# EAGLE design final_project3 (EAGLE 9.6.2)
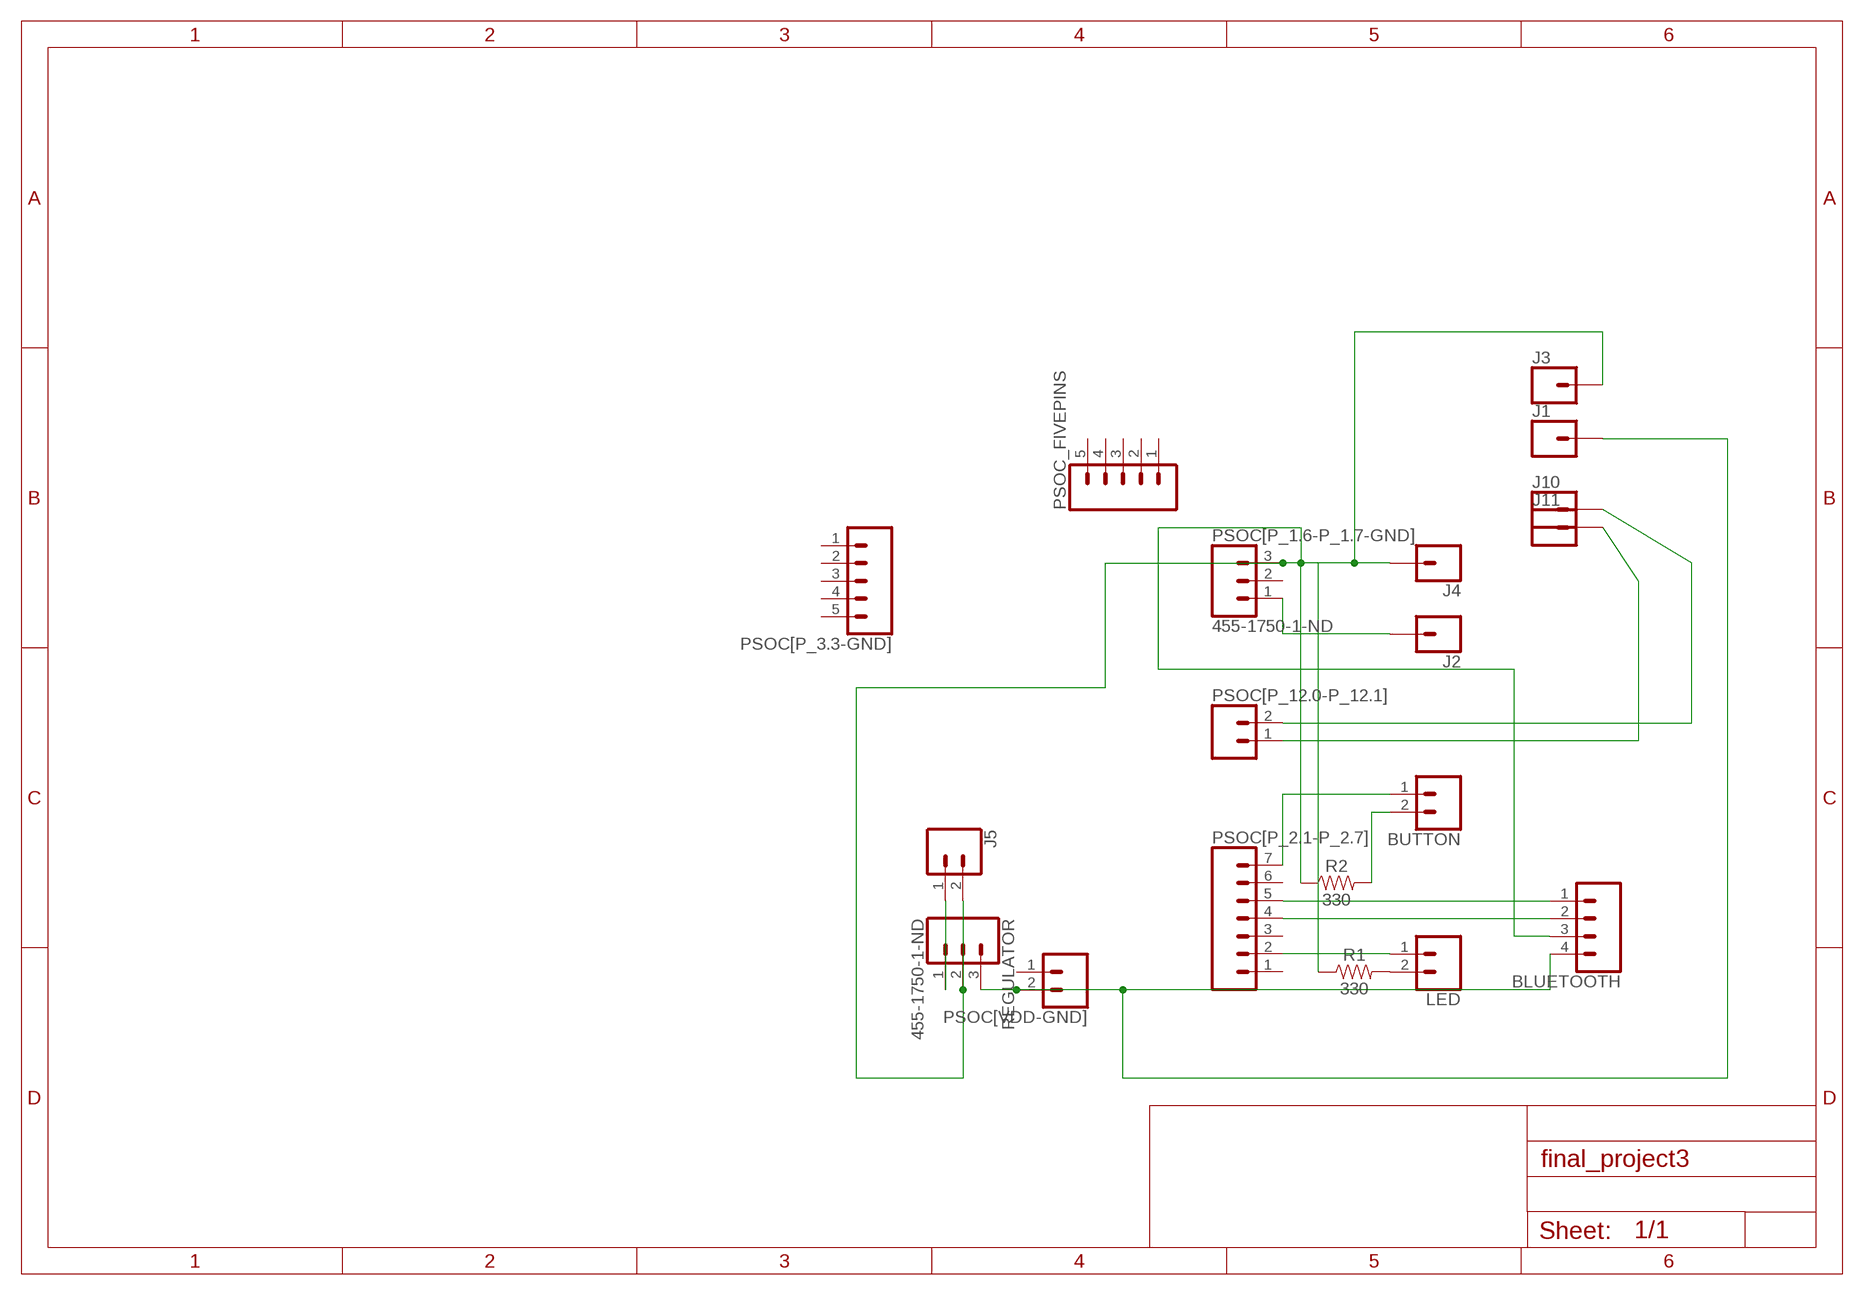
[diagram p0: schematic, sheet 1]

## Parts
BLUETOOTH  CONN_04  [1X04]
BUTTON  CONN_02  [1X02]
J1  CONN_01  [1X01]
J2  CONN_01  [1X01]
J3  CONN_01  [1X01]
J4  CONN_01  [1X01]
J5  CONN_02  [1X02]
J10  CONN_01  [1X01]
J11  CONN_01  [1X01]
LED  CONN_02  [1X02]
PSOC[P_1.6-P_1.7-GND]  455-1750-1-ND  CONN_03  [1X03]
PSOC[P_2.1-P_2.7]  CONN_07  [1X07]
PSOC[P_3.3-GND]  CONN_05  [1X05]
PSOC[P_12.0-P_12.1]  CONN_02  [1X02]
PSOC[VDD-GND]  CONN_02  [1X02]
PSOC_FIVEPINS  CONN_05  [1X05]
R1  330  330OHM-HORIZ-1/10W-5%  [AXIAL-0.3]
R2  330  330OHM-HORIZ-1/10W-5%  [AXIAL-0.3]
REGULATOR  455-1750-1-ND  CONN_03  [1X03]

## Nets
BUTTON: BUTTON.1 PSOC[P_2.1-P_2.7].7
GND3: BLUETOOTH.3 J3.1 J4.1 J5.2 PSOC[P_1.6-P_1.7-GND].3 R1.P$1 R2.P$1 REGULATOR.2
LED: LED.1 PSOC[P_2.1-P_2.7].2
N$1: J5.1 REGULATOR.1
N$2: J2.1 PSOC[P_1.6-P_1.7-GND].1
N$3: J11.1 PSOC[P_12.0-P_12.1].1
N$4: J10.1 PSOC[P_12.0-P_12.1].2
R_BUTTON: BUTTON.2 R2.P$2
R_LED: LED.2 R1.P$2
RX_BT-TX_PSOC: BLUETOOTH.1 PSOC[P_2.1-P_2.7].5
TX_BT-RX_PSOC: BLUETOOTH.2 PSOC[P_2.1-P_2.7].4
VDD: BLUETOOTH.4 J1.1 PSOC[VDD-GND].2 REGULATOR.3
Unconnected: PSOC[P_1.6-P_1.7-GND].2 PSOC[P_2.1-P_2.7].1 PSOC[P_2.1-P_2.7].3 PSOC[P_2.1-P_2.7].6 PSOC[P_3.3-GND].1 PSOC[P_3.3-GND].2 PSOC[P_3.3-GND].3 PSOC[P_3.3-GND].4 PSOC[P_3.3-GND].5 PSOC[VDD-GND].1 PSOC_FIVEPINS.1 PSOC_FIVEPINS.2 PSOC_FIVEPINS.3 PSOC_FIVEPINS.4 PSOC_FIVEPINS.5

## Library data of the parts
BLUETOOTH = SparkFun-Connectors:CONN_04: Multi connection point. Often used as Generic Header-pin footprint for 0.1 inch spaced/style header connections On any of the 0.1 inch spaced packages, you can populate with these: Break Away Headers - Straight <https://www.sparkfun.com/products/116> (PRT-00116) Break Away Male Headers - Right Angle <https://www.sparkfun.com/products/553> (PRT-00553) Female Headers <https://www.sparkfun.com/products/115> (PRT-00115) Break Away Headers - Machine Pin <https://www.sparkfun.com/products/117> (PRT-00117) Break Away Female Headers - Swiss Machine Pin <https://www.sparkfun.com/products/743> (PRT-00743) For SCREWTERMINALS and SPRING TERMINALS visit here: Screw Terimnals on SparkFun.com <https://www.sparkfun.com/search/results?term=Screw+Terminals> (5mm/3.5mm/2.54mm spacing) This device is also useful as a general connection point to wire up your design to another part of your project. Our various solder wires solder well into these plated through hole pads. Hook-Up Wire - Assortment (Stranded, 22 AWG) <https://www.sparkfun.com/products/11375> (PRT-11375) Hook-Up Wire - Assortment (Solid Core, 22 AWG) <https://www.sparkfun.com/products/11367> (PRT-11367) View the entire wire category on our website here <https://www.sparkfun.com/categories/141> Special notes: Molex polarized connector foot print use with SKU : PRT-08231 with associated crimp pins and housings. 1MM SMD Version SKU: PRT-10208; PROD_ID: CONN-09696
BUTTON J5 LED PSOC[P_12.0-P_12.1] PSOC[VDD-GND] = SparkFun-Connectors:CONN_02: Multi connection point. Often used as Generic Header-pin footprint for 0.1 inch spaced/style header connections On any of the 0.1 inch spaced packages, you can populate with these: Break Away Headers - Straight <https://www.sparkfun.com/products/116> (PRT-00116) Break Away Male Headers - Right Angle <https://www.sparkfun.com/products/553> (PRT-00553) Female Headers <https://www.sparkfun.com/products/115> (PRT-00115) Break Away Headers - Machine Pin <https://www.sparkfun.com/products/117> (PRT-00117) Break Away Female Headers - Swiss Machine Pin <https://www.sparkfun.com/products/743> (PRT-00743) For SCREWTERMINALS and SPRING TERMINALS visit here: Screw Terimnals on SparkFun.com <https://www.sparkfun.com/search/results?term=Screw+Terminals> (5mm/3.5mm/2.54mm spacing) This device is also useful as a general connection point to wire up your design to another part of your project. Our various solder wires solder well into these plated through hole pads. Hook-Up Wire - Assortment (Stranded, 22 AWG) <https://www.sparkfun.com/products/11375> (PRT-11375) Hook-Up Wire - Assortment (Solid Core, 22 AWG) <https://www.sparkfun.com/products/11367> (PRT-11367) View the entire wire category on our website here <https://www.sparkfun.com/categories/141> Special notes: Molex polarized connector foot print use with: PRT-08233 with associated crimp pins and housings. 2.54_SCREWTERM for use with PRT-10571. 3.5mm Screw Terminal footprints for PRT-08084 5mm Screw Terminal footprints for use with PRT-08432
J1-J4 J10 J11 = SparkFun-Connectors:CONN_01: Single connection point. Often used as Generic Header-pin footprint for 0.1 inch spaced/style header connections On any of the 0.1 inch spaced packages, you can populate with these: Break Away Headers - Straight <https://www.sparkfun.com/products/116> (PRT-00116) Break Away Male Headers - Right Angle <https://www.sparkfun.com/products/553> (PRT-00553) Female Headers <https://www.sparkfun.com/products/115> (PRT-00115) Break Away Headers - Machine Pin <https://www.sparkfun.com/products/117> (PRT-00117) Break Away Female Headers - Swiss Machine Pin <https://www.sparkfun.com/products/743> (PRT-00743) This device is also useful as a general connection point to wire up your design to another part of your project. Our various solder wires solder well into these plated through hole pads. Hook-Up Wire - Assortment (Stranded, 22 AWG) <https://www.sparkfun.com/products/11375> (PRT-11375) Hook-Up Wire - Assortment (Solid Core, 22 AWG) <https://www.sparkfun.com/products/11367> (PRT-11367) View the entire wire category on our website here <https://www.sparkfun.com/categories/141> Special notes: SMTSO-256-ET is a "flush mount" nut for a 4-40 screw. We mostly use this on specialty testbeds; it is a nice way to connect hardware to your PCB at an adjustable hieght. Also note, the SNAP packages are for using a snappable style connector. We sell a baggie of snaps and they are also used on two LilyPad designs: Snap Assortment - 30 pack (male and female) <https://www.sparkfun.com/products/11347> (DEV-11347) LilyPad Arduino SimpleSnap <https://www.sparkfun.com/products/10941> (DEV-10941) LilyPad SimpleSnap Protoboard <https://www.sparkfun.com/products/10940> (DEV-10940)
PSOC[P_1.6-P_1.7-GND] REGULATOR = SparkFun-Connectors:CONN_03: Multi connection point. Often used as Generic Header-pin footprint for 0.1 inch spaced/style header connections On any of the 0.1 inch spaced packages, you can populate with these: Break Away Headers - Straight <https://www.sparkfun.com/products/116> (PRT-00116) Break Away Male Headers - Right Angle <https://www.sparkfun.com/products/553> (PRT-00553) Female Headers <https://www.sparkfun.com/products/115> (PRT-00115) Break Away Headers - Machine Pin <https://www.sparkfun.com/products/117> (PRT-00117) Break Away Female Headers - Swiss Machine Pin <https://www.sparkfun.com/products/743> (PRT-00743) Stackable Header - 3 Pin (Female, 0.1") <https://www.sparkfun.com/products/13875> (PRT-13875) For SCREWTERMINALS and SPRING TERMINALS visit here: Screw Terimnals on SparkFun.com <https://www.sparkfun.com/search/results?term=Screw+Terminals> (5mm/3.5mm/2.54mm spacing) This device is also useful as a general connection point to wire up your design to another part of your project. Our various solder wires solder well into these plated through hole pads. Hook-Up Wire - Assortment (Stranded, 22 AWG) <https://www.sparkfun.com/products/11375> (PRT-11375) Hook-Up Wire - Assortment (Solid Core, 22 AWG) <https://www.sparkfun.com/products/11367> (PRT-11367) View the entire wire category on our website here <https://www.sparkfun.com/categories/141> Special notes: Molex polarized connector foot print use with SKU : PRT-08232 with associated crimp pins and housings.; PROD_ID: XXX-00000
PSOC[P_2.1-P_2.7] = SparkFun-Connectors:CONN_07: Multi connection point. Often used as Generic Header-pin footprint for 0.1 inch spaced/style header connections On any of the 0.1 inch spaced packages, you can populate with these: Break Away Headers - Straight <https://www.sparkfun.com/products/116> (PRT-00116) Break Away Male Headers - Right Angle <https://www.sparkfun.com/products/553> (PRT-00553) Female Headers <https://www.sparkfun.com/products/115> (PRT-00115) Break Away Headers - Machine Pin <https://www.sparkfun.com/products/117> (PRT-00117) Break Away Female Headers - Swiss Machine Pin <https://www.sparkfun.com/products/743> (PRT-00743) For SCREWTERMINALS and SPRING TERMINALS visit here: Screw Terimnals on SparkFun.com <https://www.sparkfun.com/search/results?term=Screw+Terminals> (5mm/3.5mm/2.54mm spacing) This device is also useful as a general connection point to wire up your design to another part of your project. Our various solder wires solder well into these plated through hole pads. Hook-Up Wire - Assortment (Stranded, 22 AWG) <https://www.sparkfun.com/products/11375> (PRT-11375) Hook-Up Wire - Assortment (Solid Core, 22 AWG) <https://www.sparkfun.com/products/11367> (PRT-11367) View the entire wire category on our website here <https://www.sparkfun.com/categories/141> Special notes: Molex polarized connector foot print use with SKU : PRT-08231 with associated crimp pins and housings. 1MM SMD Version SKU: PRT-10208 NOTES ON THE VARIANTS LOCK and LOCK_LONGPADS... This footprint was designed to help hold the alignment of a through-hole component (i.e. 6-pin header) while soldering it into place. You may notice that each hole has been shifted either up or down by 0.005 of an inch from it's more standard position (which is a perfectly straight line). This slight alteration caused the pins (the squares in the middle) to touch the edges of the holes. Because they are alternating, it causes a "brace" to hold the component in place. 0.005 has proven to be the perfect amount of "off-center" position when using our standard breakaway headers. Although looks a little odd when you look at the bare footprint, once you have a header in there, the alteration is very hard to notice. Also,if you push a header all the way into place, it is covered up entirely on the bottom side.
PSOC[P_3.3-GND] PSOC_FIVEPINS = SparkFun-Connectors:CONN_05: Multi connection point. Often used as Generic Header-pin footprint for 0.1 inch spaced/style header connections On any of the 0.1 inch spaced packages, you can populate with these: Break Away Headers - Straight <https://www.sparkfun.com/products/116> (PRT-00116) Break Away Male Headers - Right Angle <https://www.sparkfun.com/products/553> (PRT-00553) Female Headers <https://www.sparkfun.com/products/115> (PRT-00115) Break Away Headers - Machine Pin <https://www.sparkfun.com/products/117> (PRT-00117) Break Away Female Headers - Swiss Machine Pin <https://www.sparkfun.com/products/743> (PRT-00743) For SCREWTERMINALS and SPRING TERMINALS visit here: Screw Terimnals on SparkFun.com <https://www.sparkfun.com/search/results?term=Screw+Terminals> (5mm/3.5mm/2.54mm spacing) This device is also useful as a general connection point to wire up your design to another part of your project. Our various solder wires solder well into these plated through hole pads. Hook-Up Wire - Assortment (Stranded, 22 AWG) <https://www.sparkfun.com/products/11375> (PRT-11375) Hook-Up Wire - Assortment (Solid Core, 22 AWG) <https://www.sparkfun.com/products/11367> (PRT-11367) View the entire wire category on our website here <https://www.sparkfun.com/categories/141> Special notes: Molex polarized connector foot print use with SKU : PRT-08231 with associated crimp pins and housings. 1MM SMD Version SKU: PRT-10208
R1 R2 = SparkFun-Resistors:330OHM: 330Ω resistor A resistor is a passive two-terminal electrical component that implements electrical resistance as a circuit element. Resistors act to reduce current flow, and, at the same time, act to lower voltage levels within circuits. - Wikipedia; PROD_ID: RES-8371

## Board
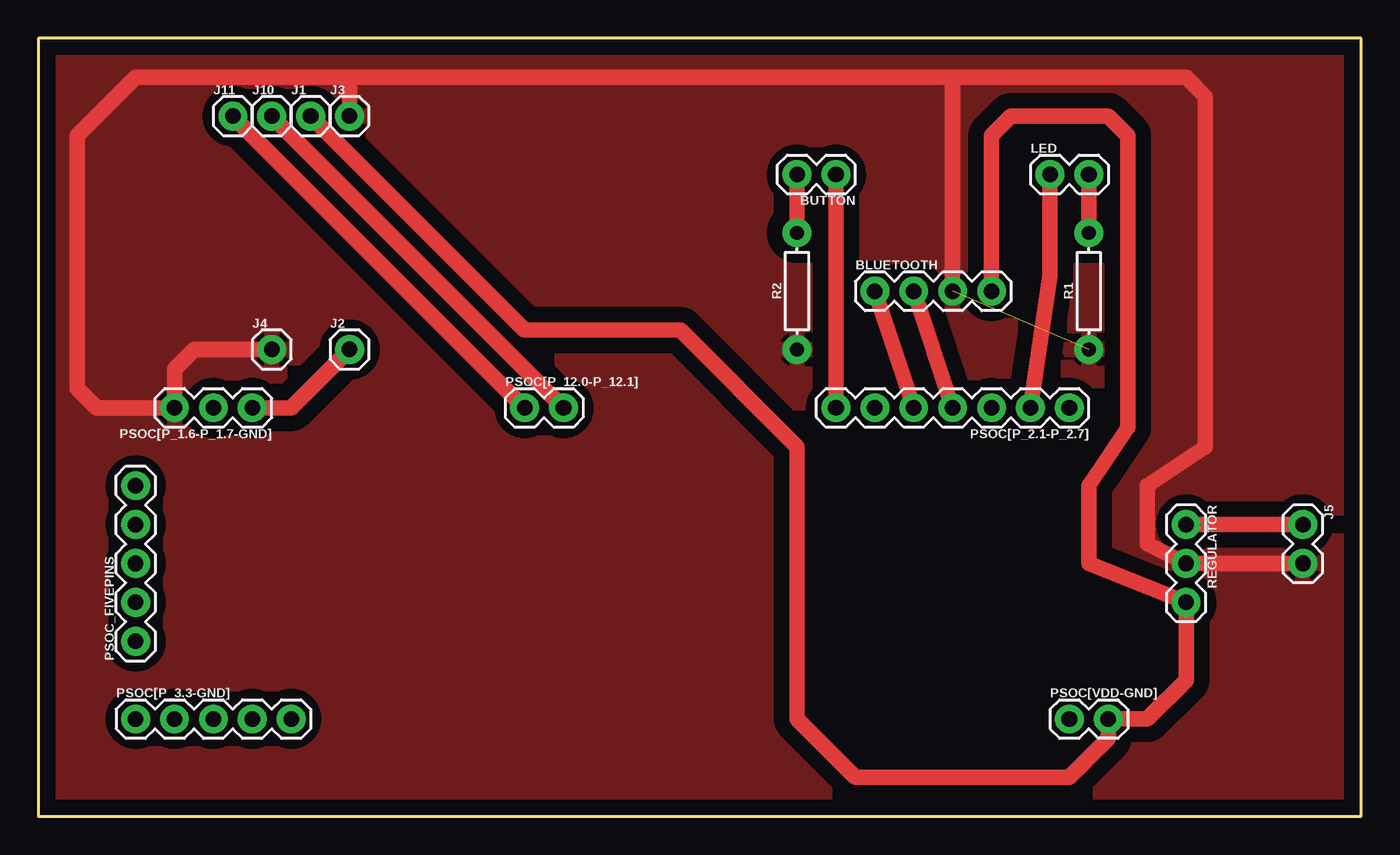
[diagram p1: board, top side]

Size 86.36 x 50.8 mm. Coordinates in mm from the lower left corner, seen from the top.
Outline: 0,0 86.36,0 86.36,50.8 0,50.8 0,0
Copper layers (1*16): Top 0.035mm / dielectric 1.5mm / Bottom 0.035mm
Design rules "default": minimum track width 6mil, minimum drill 0.35mm, track to track 6mil, track to pad 6mil, pad to pad 6mil, via to via 6mil, smd to smd 6mil, copper to edge 40mil, drill to drill 6mil, minimum pad ring 10mil, minimum via ring 8mil, stop-mask expansion 4mil, vias tented up to drill 0mil, thermal gap 10mil

### Footprints (pad centres in the part's own frame; a part is rotated, then mirrored left to right if it is on the bottom)
1X04 = drill 1.016 pad 1.88: 1 0,0; 2 2.54,0; 3 5.08,0; 4 7.62,0
1X02 = drill 1.016 pad 1.88: 1 0,0; 2 2.54,0
1X01 = drill 1.016 pad 1.88: 1 0,0
1X03 = drill 1.016 pad 1.88: 1 0,0; 2 2.54,0; 3 5.08,0
1X07 = drill 1.016 pad 1.88: 1 0,0; 2 2.54,0; 3 5.08,0; 4 7.62,0; 5 10.16,0; 6 12.7,0; 7 15.24,0
1X05 = drill 1.016 pad 1.88: 1 0,0; 2 2.54,0; 3 5.08,0; 4 7.62,0; 5 10.16,0
AXIAL-0.3 = drill 0.9 pad 1.88: P$1 -3.81,0; P$2 3.81,0

### Placement (x,y rotation side)
BLUETOOTH  54.61,34.29 0 top
BUTTON  52.07,41.91 180 top
J1  17.78,45.72 0 top
J2  20.32,30.48 0 top
J3  20.32,45.72 0 top
J4  15.24,30.48 0 top
J5  82.55,19.05 270 top
J10  15.24,45.72 0 top
J11  12.7,45.72 0 top
LED  66.04,41.91 0 top
PSOC[P_1.6-P_1.7-GND]  13.97,26.67 180 top
PSOC[P_2.1-P_2.7]  67.31,26.67 180 top
PSOC[P_3.3-GND]  6.35,6.35 0 top
PSOC[P_12.0-P_12.1]  31.75,26.67 0 top
PSOC[VDD-GND]  67.31,6.35 0 top
PSOC_FIVEPINS  6.35,11.43 90 top
R1  68.58,34.29 90 top
R2  49.53,34.29 90 top
REGULATOR  74.93,19.05 270 top

### Tracks (layer width: path | path; a pad name or v marks a point on that pad's centre or on a via)
BUTTON
  Top 1: BUTTON.1 PSOC[P_2.1-P_2.7].7
GND3  (1 unrouted)
  Top 1: BLUETOOTH.3 59.69,48.26 63.5,48.26 72.39,48.26
  Top 1.016: 63.5,48.26 20.32,48.26 | 20.32,48.26 6.35,48.26 2.54,44.45 2.54,27.94 3.81,26.67 PSOC[P_1.6-P_1.7-GND].3 8.89,29.21 10.16,30.48 J4.1 | J3.1 20.32,48.26 | J5.2 REGULATOR.2 72.39,17.78 72.39,21.59 76.2,24.13 76.2,46.99 74.93,48.26 72.39,48.26
  pour Top (isolate 1.016): 0,0 0,50.8 86.36,50.8 86.36,0
LED
  Top 1: LED.1 66.04,35.27
  Top 1.016: 66.04,35.27 PSOC[P_2.1-P_2.7].2
N$1
  Top 1.016: J5.1 REGULATOR.1
N$2
  Top 1.016: J2.1 16.51,26.67 PSOC[P_1.6-P_1.7-GND].1
N$3
  Top 1.016: J11.1 PSOC[P_12.0-P_12.1].1
N$4
  Top 1.016: J10.1 PSOC[P_12.0-P_12.1].2
R_BUTTON
  Top 1: R2.P$2 BUTTON.2
R_LED
  Top 1: R1.P$2 LED.2
RX_BT-TX_PSOC
  Top 1.016: BLUETOOTH.1 PSOC[P_2.1-P_2.7].5
TX_BT-RX_PSOC
  Top 1.016: BLUETOOTH.2 PSOC[P_2.1-P_2.7].4
VDD
  Top 1.016: J1.1 31.75,31.75 41.91,31.75 49.53,24.13 49.53,6.35 53.34,2.54 67.31,2.54 69.85,5.08 PSOC[VDD-GND].2 72.39,6.35 74.93,8.89 REGULATOR.3 68.58,16.51 68.58,21.59 71.12,25.4 71.12,30.48 71.12,44.45 69.85,45.72 63.5,45.72 62.23,44.45 BLUETOOTH.4